# EAGLE design noisy (EAGLE 8.6.1)

## Sheet 1 of 2
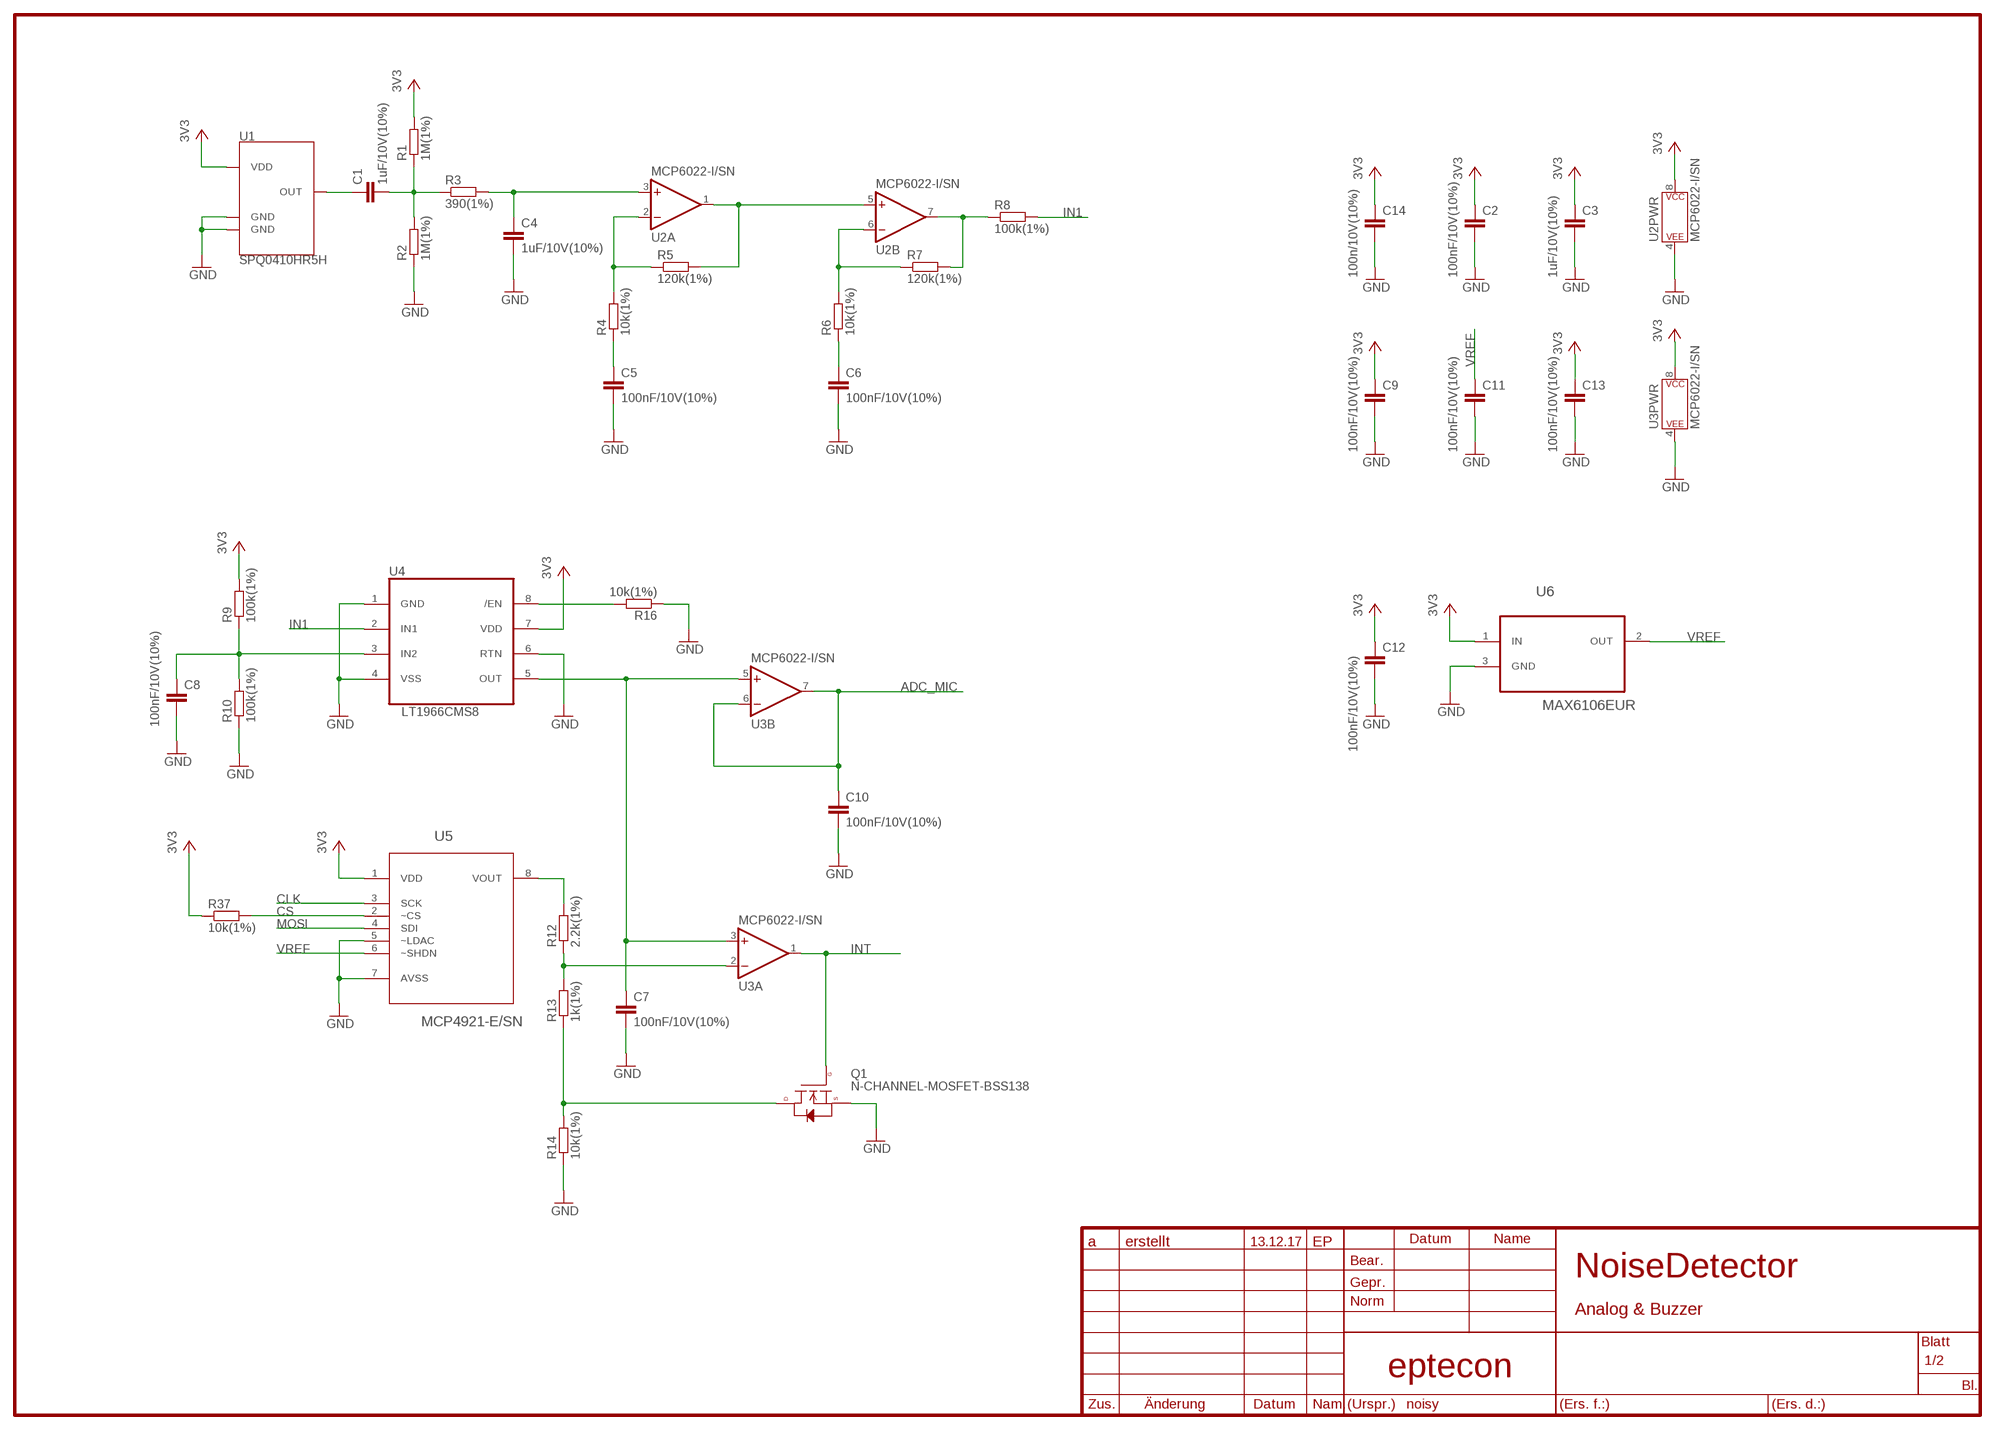
[diagram p0: schematic, sheet 1]

### Parts
C1  1uF/10V(10%)  C-EUC0603  [C0603]
C2  100nF/10V(10%)  C-EUC0603  [C0603]
C3  1uF/10V(10%)  C-EUC0603  [C0603]
C4  1uF/10V(10%)  C-EUC0603  [C0603]
C5  100nF/10V(10%)  C-EUC0603  [C0603]
C6  100nF/10V(10%)  C-EUC0603  [C0603]
C7  100nF/10V(10%)  C-EUC0603  [C0603]
C8  100nF/10V(10%)  C-EUC0603  [C0603]
C9  100nF/10V(10%)  C-EUC0603  [C0603]
C10  100nF/10V(10%)  C-EUC0603  [C0603]
C11  100nF/10V(10%)  C-EUC0603  [C0603]
C12  100nF/10V(10%)  C-EUC0603  [C0603]
C13  100nF/10V(10%)  C-EUC0603  [C0603]
C14  100n/10V(10%)  C-EUC0603  [C0603]
Q1  N-CHANNEL-MOSFET-BSS138  [SOT23-3]
R1  1M(1%)  R-EU_R0603  [R0603]
R2  1M(1%)  R-EU_R0603  [R0603]
R3  390(1%)  R-EU_R0603  [R0603]
R4  10k(1%)  R-EU_R0603  [R0603]
R5  120k(1%)  R-EU_R0603  [R0603]
R6  10k(1%)  R-EU_R0603  [R0603]
R7  120k(1%)  R-EU_R0603  [R0603]
R8  100k(1%)  R-EU_R0603  [R0603]
R9  100k(1%)  R-EU_R0603  [R0603]
R10  100k(1%)  R-EU_R0603  [R0603]
R12  2.2k(1%)  R-EU_R0603  [R0603]
R13  1k(1%)  R-EU_R0603  [R0603]
R14  10k(1%)  R-EU_R0603  [R0603]
R16  10k(1%)  R-EU_R0603  [R0603]
R37  10k(1%)  R-EU_R0603  [R0603]
U1  SPQ0410HR5H  [SPQ0410HR]
U2  MCP6022-I/SN  [SOIC08]
U3  MCP6022-I/SN  [SOIC08]
U4  LT1966CMS8  [MSOP8]
U5  MCP4921-E/SN  [SOIC8-N_MC]
U6  MAX6106EUR  [SOT23-3]

### Nets
3V3: C2.1 C3.1 C9.1 C12.1 C13.1 C14.1 R1.2 R9.2 R37.1 U1.P$1(VDD) U2.8(PWR:P$V+) U3.8(PWR:P$V+) U4.7(VDD) U5.1(VDD) U6.1(IN) ; also sheet 2
ADC_MIC: C10.1 U3.6(B:-IN) U3.7(B:OUT) ; also sheet 2
CLK: U5.3(SCK) ; also sheet 2
CS: R37.2 U5.2(~CS) ; also sheet 2
GND: C2.2 C3.2 C4.2 C5.2 C6.2 C7.2 C8.2 C9.2 C10.2 C11.2 C12.2 C13.2 C14.2 Q1.2(S) R2.1 R10.1 R14.1 R16.1 U1.P$2(GND) U1.P$3(GND) U2.4(PWR:P$V-) U3.4(PWR:P$V-) U4.1(GND) U4.4(VSS) U4.6(RTN) U5.5(~LDAC) U5.7(AVSS) U6.3(GND) ; also sheet 2
IN1: R8.2 U4.2(IN1)
INT: Q1.1(G) U3.1(A:OUT) ; also sheet 2
MOSI: U5.4(SDI) ; also sheet 2
N$1: C1.1 U1.P$4(OUT)
N$2: C1.2 R1.1 R2.2 R3.1
N$3: C4.1 R3.2 U2.3(A:+IN)
N$4: R4.2 R5.1 U2.2(A:-IN)
N$5: C5.1 R4.1
N$6: R5.2 U2.1(A:OUT) U2.5(B:+IN)
N$7: R6.2 R7.1 U2.6(B:-IN)
N$8: C6.1 R6.1
N$9: R7.2 R8.1 U2.7(B:OUT)
N$11: C8.1 R9.1 R10.2 U4.3(IN2)
N$12: R12.2 U5.8(VOUT)
N$13: R12.1 R13.2 U3.2(A:-IN)
N$14: Q1.3(D) R13.1 R14.2
N$15: C7.1 U3.3(A:+IN) U3.5(B:+IN) U4.5(OUT)
N$42: R16.2 U4.8(/EN)
VREF: C11.1 U5.6(~SHDN) U6.2(OUT)

### Notes on the sheet
- a | erstellt | 13.12.17 | EP
- NoiseDetector
- Analog & Buzzer
- eptecon

## Sheet 2 of 2
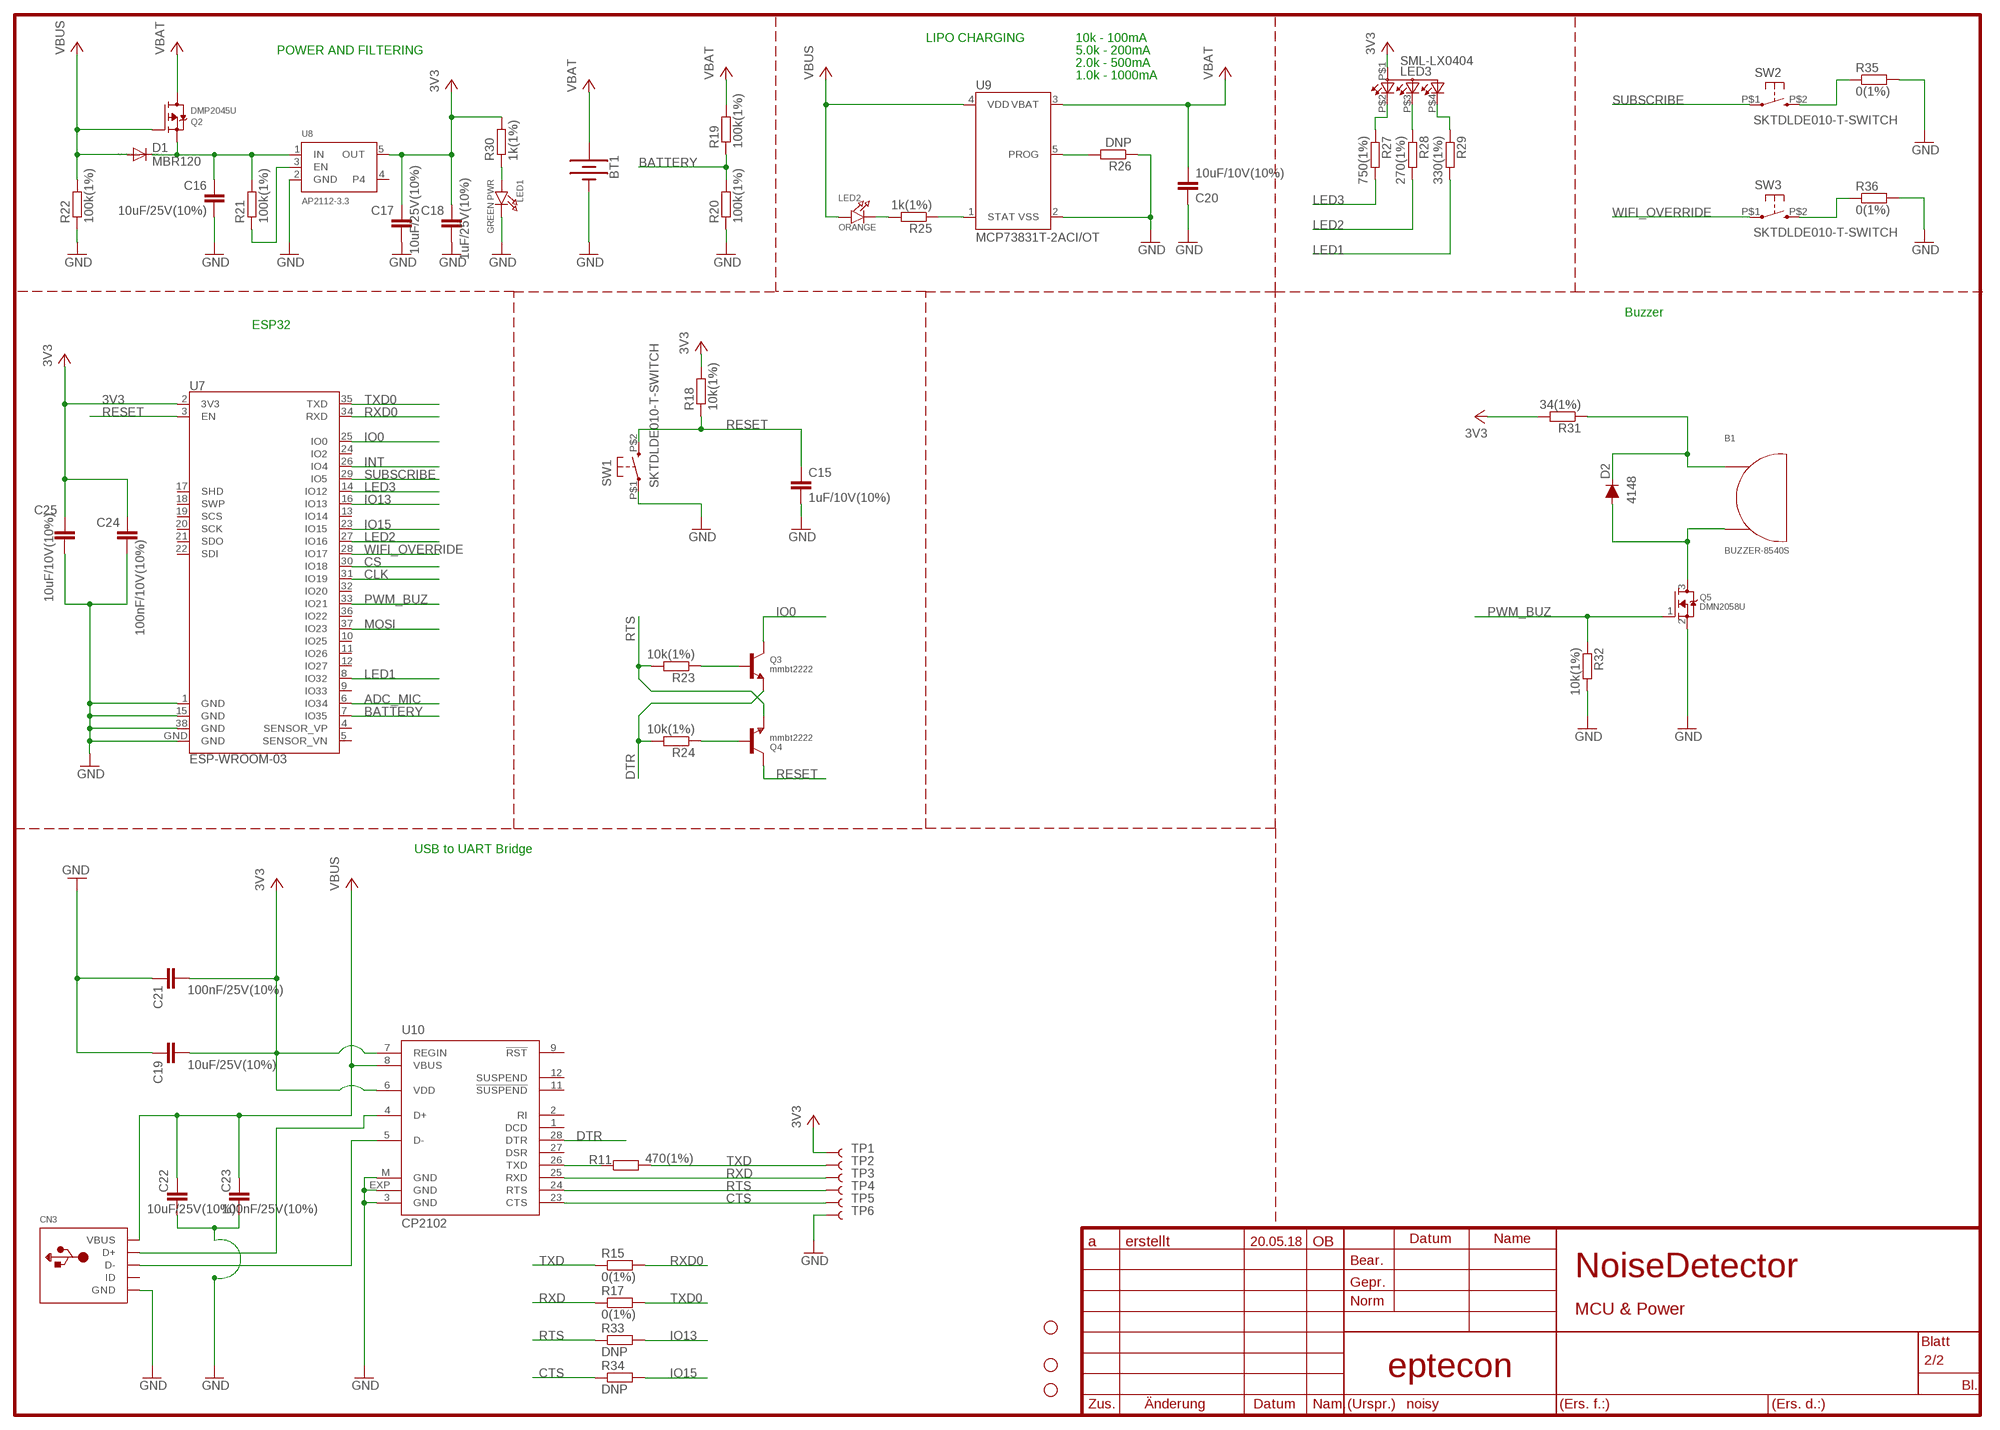
[diagram p1: schematic, sheet 2]

### Parts
B1  BUZZER-8540S  [BUZZER-8540S]
BT1  BATTERY-AA  [BATTERY-AA]
C15  1uF/10V(10%)  C-EUC0603  [C0603]
C16  10uF/25V(10%)  C-EUC0603  [C0603]
C17  10uF/25V(10%)  C-EUC0603  [C0603]
C18  1uF/25V(10%)  C-EUC0603  [C0603]
C19  10uF/25V(10%)  C-EUC0603  [C0603]
C20  10uF/10V(10%)  C-EUC0603  [C0603]
C21  100nF/25V(10%)  C-EUC0603  [C0603]
C22  10uF/25V(10%)  C-EUC0603  [C0603]
C23  100nF/25V(10%)  C-EUC0603  [C0603]
C24  100nF/10V(10%)  C-EUC0603  [C0603]
C25  10uF/10V(10%)  C-EUC0603  [C0603]
CN3  USBMINIBLARGE  [USB-MINIB_LARGER]
D1  MBR120  MBR0520LT  [SOD123]
D2  4148  DIODE-BAS16J  [SOD-323]
H1  STAND-OFF  [STAND-OFF]
H2  STAND-OFF  [STAND-OFF]
H3  STAND-OFF  [STAND-OFF]
LED1  GREEN PWR  LED0805_NOOUTLINE  [CHIPLED_0805_NOOUTLINE]
LED2  ORANGE  LED0805_NOOUTLINE  [CHIPLED_0805_NOOUTLINE]
LED3  SML-LX0404  [LED_RGB]
Q2  DMP2045U  MOSFET-P  [SOT23-R]
Q3  mmbt2222  TRANSISTOR_NPN  [SOT23-R]
Q4  mmbt2222  TRANSISTOR_NPN  [SOT23-R]
Q5  DMN2058U  MOSFET-NREFLOW  [SOT23-R]
R11  470(1%)  R-EU_R0603  [R0603]
R15  0(1%)  R-EU_R0603  [R0603]
R17  0(1%)  R-EU_R0603  [R0603]
R18  10k(1%)  R-EU_R0603  [R0603]
R19  100k(1%)  R-EU_R0603  [R0603]
R20  100k(1%)  R-EU_R0603  [R0603]
R21  100k(1%)  R-EU_R0603  [R0603]
R22  100k(1%)  R-EU_R0603  [R0603]
R23  10k(1%)  R-EU_R0603  [R0603]
R24  10k(1%)  R-EU_R0603  [R0603]
R25  1k(1%)  R-EU_R0603  [R0603]
R26  DNP  R-EU_R0603  [R0603]
R27  750(1%)  R-EU_R0603  [R0603]
R28  270(1%)  R-EU_R0603  [R0603]
R29  330(1%)  R-EU_R0603  [R0603]
R30  1k(1%)  R-EU_R0603  [R0603]
R31  34(1%)  R-EU_R0603  [R0603]
R32  10k(1%)  R-EU_R0603  [R0603]
R33  DNP  R-EU_R0603  [R0603]
R34  DNP  R-EU_R0603  [R0603]
R35  0(1%)  R-EU_R0603  [R0603]
R36  0(1%)  R-EU_R0603  [R0603]
SW1  SKTDLDE010-T-SWITCH  [T-SWITCH-ALPS-2]
SW2  SKTDLDE010-T-SWITCH  [T-SWITCH-ALPS-2]
SW3  SKTDLDE010-T-SWITCH  [T-SWITCH-ALPS-2]
TP1  TEST-POINT3X5  [PAD.03X.05]
TP2  TEST-POINT3X5  [PAD.03X.05]
TP3  TEST-POINT3X5  [PAD.03X.05]
TP4  TEST-POINT3X5  [PAD.03X.05]
TP5  TEST-POINT3X5  [PAD.03X.05]
TP6  TEST-POINT3X5  [PAD.03X.05]
U7  ESP-WROOM-03  [ESP-WROOM-03]
U8  AP2112-3.3  VREG_SOT23-5  [SOT23-5]
U9  MCP73831T-2ACI/OT  MCP73831  [SOT23-5]
U10  CP2102  [MLP28]

### Nets
3V3: C17.1 C18.1 C19.2 C21.2 C24.1 C25.1 LED3.P$1(A2) R18.2 R30.2 R31.2 TP1.P$1 U7.2(3V3) U8.5(OUT) U10.6(VDD) U10.7(REGIN) ; also sheet 1
ADC_MIC: U7.6(IO34) ; also sheet 1
BATTERY: R19.1 R20.2 U7.7(IO35)
CLK: U7.31(IO19) ; also sheet 1
CS: U7.30(IO18) ; also sheet 1
CTS: R34.1 TP5.P$1 U10.23(CTS)
DTR: Q3.2(E) R24.2 U10.28(DTR)
GND: BT1.GND@1(-) C15.2 C16.2 C17.2 C18.2 C19.1 C20.1 C21.1 C22.1 C23.1 C24.2 C25.2 CN3.GND LED1.C Q5.2(S) R20.1 R22.1 R26.1 R32.2 R35.2 R36.2 SW1.P$1 TP6.P$1 U7.1(GND) U7.15(GND) U7.38(GND) U7.GND U8.2(GND) U9.2(VSS) U10.3(GND) U10.EXP(GND) U10.M(GND) ; also sheet 1
INT: U7.26(IO4) ; also sheet 1
IO0: Q3.3(C) U7.25(IO0)
IO13: R33.2 U7.16(IO13)
IO15: R34.2 U7.23(IO15)
LED1: R29.2 U7.8(IO32)
LED2: R28.2 U7.27(IO16)
LED3: R27.2 U7.14(IO12)
MOSI: U7.37(IO23) ; also sheet 1
N$10: C16.1 D1.C Q2.2(S) R21.2 U8.1(IN)
N$24: Q4.1(B) R24.1
N$25: R11.1 U10.26(TXD)
N$26: Q3.1(B) R23.1
N$27: CN3.D+ U10.4(D+)
N$28: CN3.D- U10.5(D-)
N$29: R35.1 SW2.P$2
N$31: R36.1 SW3.P$2
N$32: LED3.P$2(CRED) R27.1
N$33: R25.1 U9.1(STAT)
N$34: LED2.C R25.2
N$35: LED3.P$3(CBLUE) R28.1
N$36: LED3.P$4(CGREEN) R29.1
N$37: R26.2 U9.5(PROG)
N$38: R21.1 U8.3(EN)
N$39: LED1.A R30.1
N$40: B1.PLUS D2.C R31.1
N$41: B1.MINUS D2.A Q5.3(D)
PWM_BUZ: Q5.1(G) R32.1 U7.33(IO21)
RESET: C15.1 Q4.3(C) R18.1 SW1.P$2 U7.3(EN)
RTS: Q4.2(E) R23.2 R33.1 TP4.P$1 U10.24(RTS)
RXD: R17.1 TP3.P$1 U10.25(RXD)
RXD0: R15.2 U7.34(RXD)
SUBSCRIBE: SW2.P$1 U7.29(IO5)
TXD: R11.2 R15.1 TP2.P$1
TXD0: R17.2 U7.35(TXD)
VBAT: BT1.PWR@1(+) C20.2 Q2.3(D) R19.2 U9.3(VBAT)
VBUS: C22.2 C23.2 CN3.VBUS D1.A LED2.A Q2.1(G) R22.2 U9.4(VDD) U10.8(VBUS)
WIFI_OVERRIDE: SW3.P$1 U7.28(IO17)
Unconnected: CN3.ID U7.4(SENSOR_VP) U7.5(SENSOR_VN) U7.9(IO33) U7.10(IO25) U7.11(IO26) U7.12(IO27) U7.13(IO14) U7.17(SHD) U7.18(SWP) U7.19(SCS) U7.20(SCK) U7.21(SDO) U7.22(SDI) U7.24(IO2) U7.32(IO20) U7.36(IO22) U8.4 U10.1(DCD) U10.2(RI) U10.9(!RST) U10.11(!SUSPEND) U10.12(SUSPEND) U10.27(DSR)

### Notes on the sheet
- LIPO CHARGING | 10k - 100mA
- POWER AND FILTERING | 5.0k - 200mA
- 2.0k - 500mA
- 1.0k - 1000mA
- Buzzer
- ESP32
- USB to UART Bridge
- a | erstellt | 20.05.18 | OB
- NoiseDetector
- MCU & Power
- eptecon

## Library data of the parts
B1 = GueLogics:BUZZER-8540S
BT1 = SparkFun-Batteries:BATTERY: Battery - Single Cell A variety of battery chemistries, sizes, and footprints. Device List: 20MM_PTH - Coin Cell Battery Holder - 20mm (PTH) <https://www.sparkfun.com/products/783> 6.8MM_PTH - Coin Cell Battery Holder - 6.8MM(SMD) <https://www.digikey.com/product-detail/en/seiko-instruments/MS621FE-FL11E/728-1057-ND/1889208?WT.srch=1&gclid=CNOQ5a6LzdQCFZS2wAodXCkE0g> 12MM_SMD - Coin Cell Battery Holder - 12mm (SMD) <https://www.sparkfun.com/products/10592> 12MM_PTH - Coin Cell Battery Holder - 12mm (PTH) <https://www.sparkfun.com/products/7948> 20MM_SMD - 20mm Coin Cell Battery Holder (SMD) (2 legs) Used on the Big Time Watch Kit <https://www.sparkfun.com/products/11734> 20MM_SMD_4LEGS - Coin Cell Battery Holder - 20mm (SMD) <https://www.sparkfun.com/products/11892> 20MM_SMD_4LEGS_OVERPASTE - Coin Cell Battery Holder - 20mm (SMD) <https://www.sparkfun.com/products/11892> (Over-paste on the legs) 24.5MM_PTH - Coin Cell Battery Holder - 24.5mm (PTH) <https://www.sparkfun.com/products/8863> 9V - 9V Battery Holder - PC Mount Used on the SparkFun SparkPunk Sound Kit <https://www.sparkfun.com/products/11177> and SparkFun SparkPunk Sequencer Kit <https://www.sparkfun.com/products/12707> 18650 - Battery Holder - 18650 (PTH) <https://www.sparkfun.com/products/13113> AA - Battery Holder - 1xAA (PTH) <https://www.sparkfun.com/products/7949> AAA - Battery Holder - 1xAAA (PTH) <https://www.sparkfun.com/products/12718> AA_KIT - Battery Holder - 1xAA (PTH) <https://www.sparkfun.com/products/7949> Special kit package - pads only have exposed copper on one side of the board. AAA_KIT - Battery Holder - 1xAAA (PTH) <https://www.sparkfun.com/products/12718> Special kit package - pads only have exposed copper on one side of the board.; PROD_ID: BATT-08316; SF_SKU: PRT-07949
C1-C25 = rcl:C-EU: CAPACITOR, European symbol
CN3 = microbuilder:USB: USB Connectors USBMINIB - Surface Mount Female Mini-B USB Connector 4UConnector: 06564
D1 = diode:MBR0520LT: SCHOTTKY BARRIER RECTIFIER Source: http://onsemi.com .. MBR0520LT1-D.pdf
D2 = SparkFun-DiscreteSemi:DIODE: Diode These are standard reverse protection diodes and small signal diodes. SparkFun Products: SparkFun SparkPunk Sound Kit <https://www.sparkfun.com/products/11177> SparkFun ESP8266 Thing <https://www.sparkfun.com/products/13231>; PROD_ID: DIO-09646; VALUE: 250mA/100V
H1-H3 = SparkFun-Hardware:STAND-OFF: Stand Off Drill holes for mechanically mounting via screws, standoffs, etc. Note: Use the keepout ring to avoid running the screw head into surrounding components. Variant Overviews STAND-OFF - Mechanical footprint for a #4 phillips button head screw. STAND-OFF-TIGHT - Mechanical footprint for a #4 phillips button head screw, Example SparkFun Products Screw - Phillips Head (1/4", 4-40, 10 pack) <https://www.sparkfun.com/products/10453> (PRT-10453) Screw - Phillips Head (1/2", 4-40, 10 pack) <https://www.sparkfun.com/products/10452> (PRT-10452) Screw - Phillips Head (3/4", 4-40, 10 pack) <https://www.sparkfun.com/products/10451> (PRT-10451) Screw - Phillips Head (1", 4-40, 10 pack) <https://www.sparkfun.com/products/10450> (PRT-10450)
LED1 LED2 = microbuilder:LED: LED 0603 - 0603 Surface Mount Package 2mA: Green LED - Low Power (3.9mcd, 2ma, 1.7Vf) - Digikey: 475-2709-2-ND Orange LED - Low Power (9.8mcd, 2ma, 1.8Vf) - Digikey: 475-1194-2-ND Red LED - Low Power (5mcd, 2ma, 1.8Vf) - Digikey: 475-1195-2-ND Yellow LED - Low Power (7mcd, 2ma, 1.8Vf) - Digikey: 475-1196-2-ND 5mA: Blue LED - Low Power (17mcd, 5ma, 2.9Vf) - Digikey: LNJ937W8CRACT-ND 0805 - 0805 Surface Mount Package 2mA: Red LED (8.8mcd, 2mA, 1.8Vf, Clear) - Low Power [Digikey: 475-2510-1-ND] Green LED (5mcd, 2mA, 1.8Vf, Clear) - Low Power [Digikey: 475-2730-1-ND] Yellow LED (11.3mcd, 2mA, 1.8Vf, Clear) - Low Power [Digikey: 475-2555-1-ND] 20mA: Red LED (104mcd, 20mA, Diffused) - LS R976 [Digikey: 475-1278-6-ND] Red LED (12mcd, 20mA, 2.0Vf, Clear) - APT2012EC [Digikey: 754-1128-1-ND] Green LED (15mcd, 20mA, 2.2Vf, Clear) - APT2012GC [Digikey: 754-1131-1-ND] Orange LED (160mcd, 20mA, 2.1Vf, Clear) - APT2012SECK [Digikey: 754-1130-1-ND] 1206 - 1206 Surface Mount Package Green LED (26mcd, 20mA, Diffused) - LG N971 [Digikey: 475-1407-6-ND] Red LED (15mcd, 20mA, Diffused) - LH N974 [Digikey: 475-1416-6-ND]
LED3 = led:SML-LX0404
Q1 = GeekAmmo:N-CHANNEL-MOSFET: N-Channel MOSFET Mode Field Effect Transistor; DATASHEET: http://www.fairchildsemi.com/ds/BS/BSS138.pdf; DIGIKEY: BSS138TR-ND; ELEMENT14: 2323154; URL: http://au.element14.com/fairchild-semiconductor/bss138/mosfet-n-ch-50v-220ma-sot-23/dp/2323154
Q2 = microbuilder:MOSFET-P: P-Channel Mosfet LEGEND VDS: Voltage Drain-Source ID: Drain Current RDS(ON): Drain-Source On-State Resistance VGS(TH): Gate-Source Threshold Voltage CISS: Drain-Source Input Capacitance SOT-23 Name VDS ID RDS(ON) VGS(TH) CISS Order Number IRLML5103 30V 760mA 600 mOhm -- 75pF @ 25V Digikey: IRLML5103PBFCT-ND IRLML6401 12V 4.3A 50 mOhm 950mV @ 250µA 830pF @ 10V Digikey: IRLML6401PBFTR-ND NTR0202PL 20V 400mA 800 mOhm 2.3V @ 250uA 70pF @ 5V Digikey: NTR0202PLT1GOSTR-ND NTR4101PT1G 20V 1.8A 85 mOhm 1.2V @ 250uA 675pF @ 10V Digikey: NTR4101PT1GOSCT-ND DMP2004K 20V 600mA 900 mOhm 1V @ 250uA 175pF @ 16V Digikey: DMP2004KDICT-ND PMV65XP 20V 3.9A 76 mOhm 950mV @ 1mA 725pF @ 20V Digikey: 568-2358-2-ND TO-252 Name VDS ID RDS(ON) VGS(TH) CISS Order Number AOD417 30V 25A 34 mOhm 3V @ 250µA 920pF @ 15V Digikey: 785-1106-2-ND
Q3 Q4 = microbuilder:TRANSISTOR_NPN: NPN Transistor Transistor (NPN) 500mA 45V - BC817 [Digikey: 568-1631-1-ND] Transistor (NPN) 500mA 45V - BC817,215 [Mouser: 771-BC817-T/R] SOT23-R - SOT23 footprint optimised for use with solder paste and reflow ovens. SOT23-W - SOT23 footprint optimised for hand-soldering (larger pads).
Q5 = microbuilder:MOSFET-N: N-Channel Mosfet LEGEND VDS: Voltage Drain-Source ID: Drain Current RDS(ON): Drain-Source On-State Resistance VGS(TH): Gate-Source Threshold Voltage CISS: Drain-Source Input Capacitance SOT-23 Name VDS ID RDS(ON) VGS(TH) CISS Order Number 2N7002E 60V 260mA 2.5 Ohm 2.5V @ 250uA 26.7pF @ 25V 2N7002ET1GOSTR-ND BSH103 30V 850mA 400 mOhm 400mV @ 1mA 83pF @ 24V BSH103,235-ND BSS138 60V 320mA 1.6 Ohm 1.5V @ 250uA 50pF @ 10V Mouser: 771-BSS138PW115 DMN2075U-7 20V 4.2A 38 mOhm 1V @ 250 uA 594.3pF @ 10V DMN2075U-7DICT-ND * BSS138 good choice for I2C level-shifting
R1-R37 = rcl:R-EU_: RESISTOR, European symbol
SW1-SW3 = GeekAmmo:SKTDLDE010-T-SWITCH
TP1-TP6 = SparkFun-Connectors:TEST-POINT: SparkFun Test Points Bare copper test points for troubleshooting or In-Circuit-Testing. These are used by our Production team for verifying production board runs using pogo-pins on test beds. SparkFun Products: SparkFun LSM9DS1 Breakout <https://www.sparkfun.com/products/13284> SparkFun PSOC <https://www.sparkfun.com/products/13714> SparkFun Load Cell Amplifier <https://www.sparkfun.com/products/13879>
U1 = GueLogics:SPQ0410HR5H: MESM microphone
U2 U3 = GueLogics:MCP6022-I/SN: IC OPAMP 2.5V DUAL R-R
U4 = GueLogics:LT1966CMS8: Precision Micropower, DS RMS-to-DC Converter
U5 = Microchip_By_element14_Batch_1:MCP4921-E/SN: 12 Bit DAC; DESCRIPTION: 12 Bit DAC; MPN: MCP4921-E/SN; OC_FARNELL: 1332113; OC_NEWARK: 08J8744; PACKAGE: SOIC-8; SUPPLIER: Microchip
U6 = GueLogics:MAX6106EUR: VOLTAGE REFERENCE
U7 = esp32-thing-temp:ESP-WROOM-03
U8 = microbuilder:VREG_SOT23-5: SOT23-5 Fixed Voltage Regulators To better organise some of the SOT23-5 fixed voltage regulators in this library, this new part was created. Part Current Out V Out V In V Dropout Digikey Part No. ADP121 150mA 3.3V 3.4-5.5V 0.09V @ 150mA ADP121-AUJZ33R7CT-ND ADP121 150mA 3.0V 3.1-5.5V 0.09V @ 150mA ADP121-AUJZ30R7CT-ND ADP122 300mA 3.3V 3.4-5.5V 0.085V @ 300mA ADP122AUJZ-3.3-R7CT-ND ADP1712 300mA 3.3V 3.5-5.5V 0.17V @ 300mA ADP1712AUJZ-3.3-R7TR-ND AP7311 (Low Cost) 150mA 3.3V 3.5-6V 0.15V @ 150mA AP7311-33WG-7DICT-ND LD39015M18R 150mA 1.8V 1.9V-5.5V 0.08V @ 100mA 497-6977-1-ND MCP1824T-3302E/OT 300mA 3.3V 3.5V-6V 0.2V @ 300mA MCP1824T-3302E/OTCT-ND MIC5205-2.5YM5 TR 150mA 2.5V 2.7-16V 0.165V @ 150mA 576-1257-2-ND MIC5205-3.0YM5 TR 150mA 3.0V 3.2V-16V 0.165V @ 150mA 576-1258-2-ND MIC5205-3.3YM5 TR 150mA 3.3V 3.5V-16V 0.165V @ 150mA 576-1259-2-ND TPS780330220 150mA 3.3V+2.2V 3.6-5.5V 250mV Max 296-23332-1-ND TDA3663/N1,135 100mA 3.3V 3.5-45V 0.18V @ 50mA 568-5343-1-ND
U9 = GeekAmmo:MCP73831: MCP73831 Miniature Single-Cell, Fully Integrated Li-Ion, Li-Polymer Charge Management Controllers The MCP73831/2 devices are highly advanced linear charge management controllers for use in spacelimited, cost-sensitive applications. http://ww1.microchip.com/downloads/en/DeviceDoc/20001984F.pdf
U10 = silabs:CP210*: Single-Chip USB to UART Bridge Source: www.silabs.com .. CP2101.pdf / cp2102.pdf; MF: FARNELL; MPN: CP2102-GM; OC_FARNELL: 9282130; OC_NEWARK: 30K5635

## Board
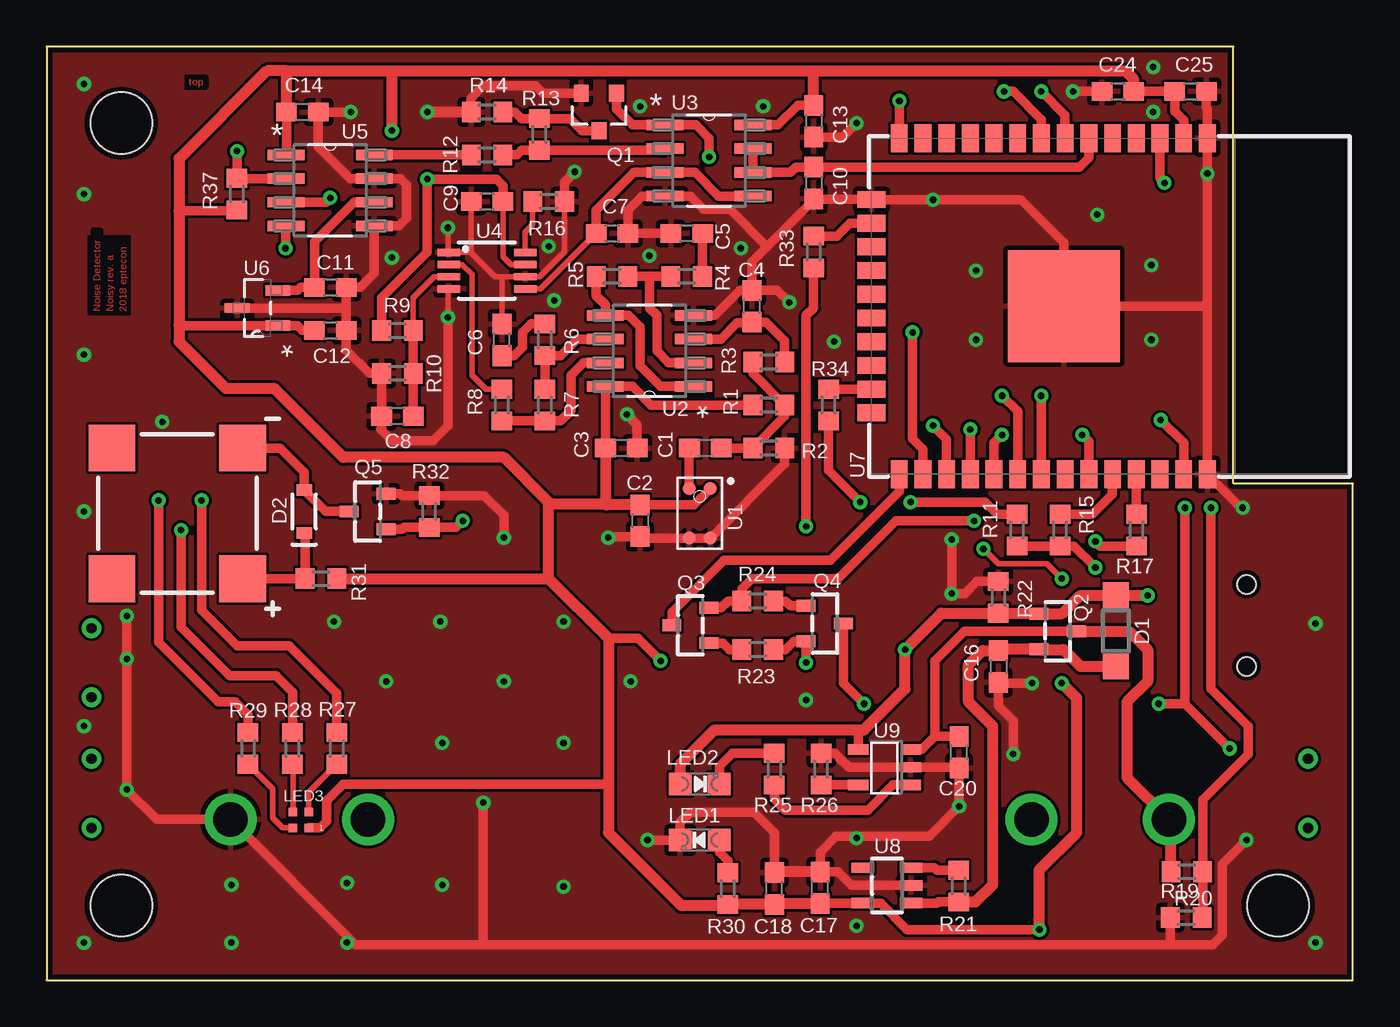
[diagram p2: board, top side]
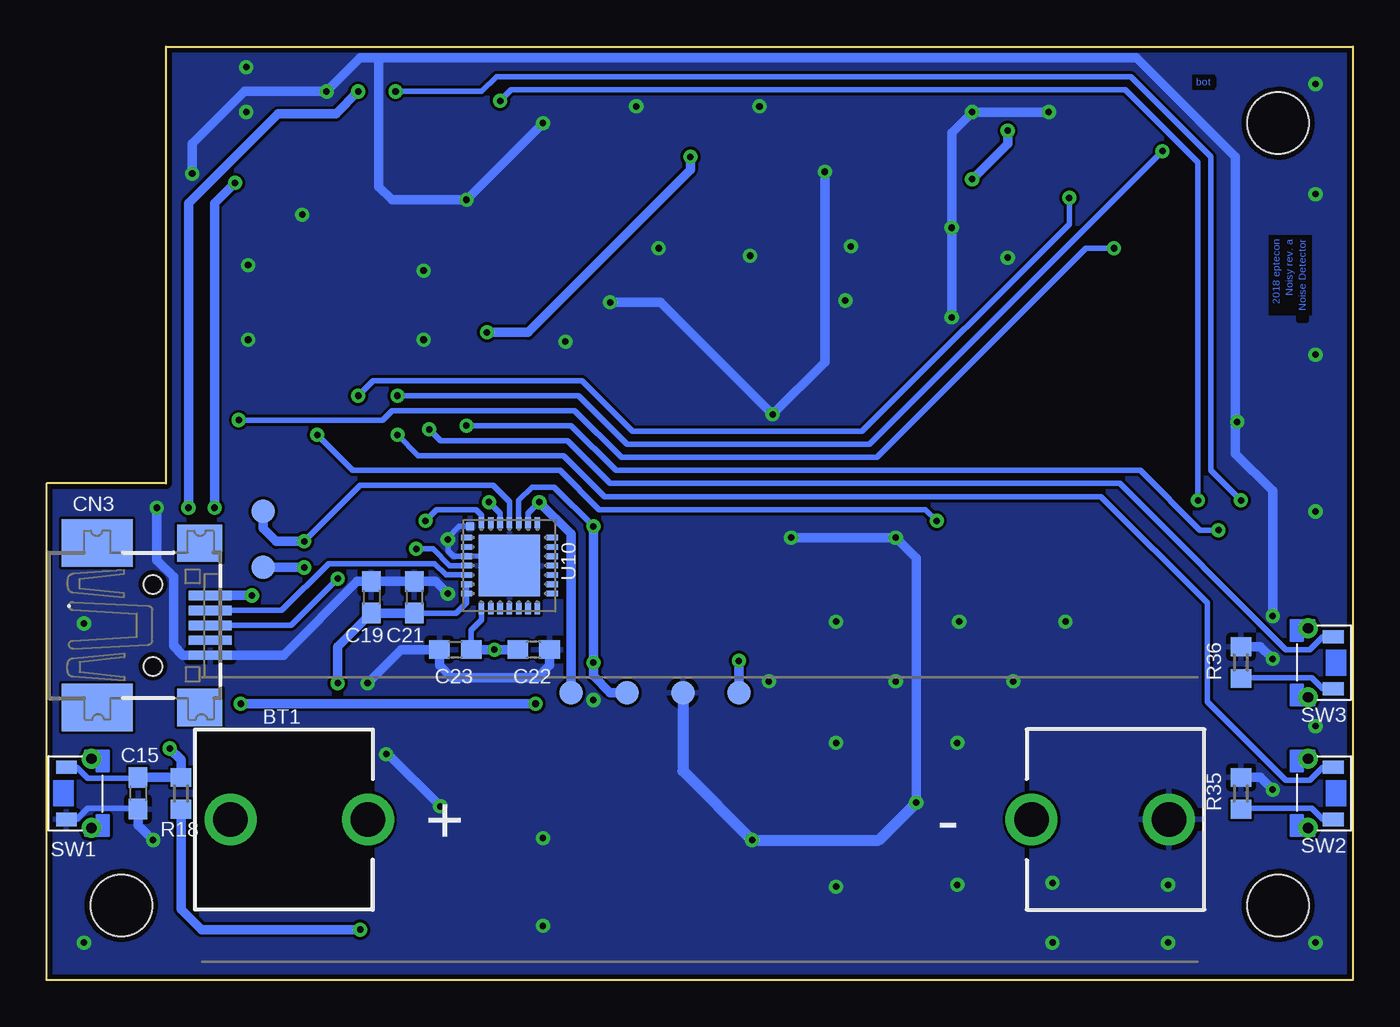
[diagram p3: board, bottom side, seen from below]

Size 70 x 50 mm. Coordinates in mm from the lower left corner, seen from the top.
Outline: 0,0 70,0 70,26.6 63.6,26.6 63.6,50 0,50 0,0
Copper layers (1*16): Top 0.035mm / dielectric 1.5mm / Bottom 0.035mm
Design rules "default *": minimum track width 10mil, minimum drill 10mil, track to track 6mil, track to pad 6mil, pad to pad 6mil, via to via 6mil, smd to smd 6mil, copper to edge 10mil, drill to drill 8mil, minimum pad ring 10mil, minimum via ring 8mil, stop-mask expansion 4mil, vias tented up to drill 0mil, thermal gap 10mil
tRestrict: area 2.2,35.6 to 4.5,39.9; area 7.4,47.7 to 8.6,48.5
bRestrict: area 2.2,35.6 to 4.5,39.9; area 7.4,47.7 to 8.6,48.5

### Footprints (pad centres in the part's own frame; a part is rotated, then mirrored left to right if it is on the bottom)
BUZZER-8540S = smd 2.5 x 2.5: 3 3.5,-3.5; 4 3.5,3.5; MINUS -3.5,-3.5; PLUS -3.5,3.5
BATTERY-AA = drill 1.854: GND@1 25.146,0; GND@2 17.78,0; PWR@1 -25.146,0; PWR@2 -17.78,0
C0603 = smd 1.1 x 1: 1 -0.85,0; 2 0.85,0
USB-MINIB_LARGER = smd 0.5 x 2.308: D+ 0,4.064; D- -0.8,4.064; GND 1.6,4.064; ID 0.8,4.064; VBUS -1.6,4.064 | smd 2.54 x 3.81: GND1 -4.4,-2; GND4 4.4,-2 | smd 2 x 2.4: GND2 -4.4,3.5; GND3 4.4,3.5 | hole 1: -2.2,1; 2.2,1
SOD123 = smd 1.4 x 1.4: A 1.9,0; C -1.9,0
SOD-323 = smd 0.63 x 0.83: A 1.15,0; C -1.15,0
STAND-OFF = hole 3.302: 0,0
CHIPLED_0805_NOOUTLINE = smd 1.2 x 1.2: A 0,-1.05; C 0,1.05
LED_RGB = smd 0.45 x 0.45: P$1 -0.45,-0.45; P$2 0.4,-0.45; P$3 0.4,0.4; P$4 -0.45,0.4
SOT23-3 = smd 0.8 x 0.9: 1 -0.95,-1; 2 0.95,-1; 3 0,1
SOT23-R = smd 0.635 x 1.016: 1 -0.95,-1; 2 0.95,-1; 3 0,1
R0603 = smd 1 x 1.1: 1 -0.85,0; 2 0.85,0
T-SWITCH-ALPS-2 = smd 0.7 x 1.1: P$1 -1.4,1.35; P$2 1.4,1.35 | drill 0.55 pad 0.6: P$3 -1.85,0; P$4 1.85,0
PAD.03X.05 = smd 1.27 x 1.27: P$1 0,0
SPQ0410HR = smd 0.7 x 0.7: P$1 0.575,1.33; P$2 0.575,-1.33; P$3 -0.575,-1.33; P$4 -0.575,1.33
SOIC08 = smd 1.981 x 0.559: 1 -2.362,1.905; 2 -2.362,0.635; 3 -2.362,-0.635; 4 -2.362,-1.905; 5 2.362,-1.905; 6 2.362,-0.635; 7 2.362,0.635; 8 2.362,1.905
MSOP8 = smd 0.4 x 1.2: 1 -0.975,-2.05; 2 -0.325,-2.05; 3 0.325,-2.05; 4 0.975,-2.05; 5 0.975,2.05; 6 0.325,2.05; 7 -0.325,2.05; 8 -0.975,2.05
SOIC8-N_MC = smd 1.981 x 0.559: 1 -2.362,1.905; 2 -2.362,0.635; 3 -2.362,-0.635; 4 -2.362,-1.905; 5 2.362,-1.905; 6 2.362,-0.635; 7 2.362,0.635; 8 2.362,1.905
SOT23-3' = smd 1.321 x 0.559: 1 -1.092,0.94; 2 -1.092,-0.94 | smd 1.321 x 0.508: 3 1.092,0
ESP-WROOM-03 = smd 0.9 x 1.5: 1 7.7,9; 2 6.43,9; 3 5.16,9; 4 3.89,9; 5 2.62,9; 6 1.35,9; 7 0.08,9; 8 -1.19,9; 9 -2.46,9; 10 -3.73,9; 11 -5,9; 12 -6.27,9; 13 -7.54,9; 14 -8.81,9; 25 -8.81,-9; 26 -7.54,-9; 27 -6.27,-9; 28 -5,-9; 29 -3.73,-9; 30 -2.46,-9; 31 -1.19,-9; 32 0.08,-9; 33 1.35,-9; 34 2.62,-9; 35 3.89,-9; 36 5.16,-9; 37 6.43,-9; 38 7.7,-9 | smd 1.5 x 0.9: 15 -10.3,5.715; 16 -10.3,4.445; 17 -10.3,3.175; 18 -10.3,1.905; 19 -10.3,0.635; 20 -10.3,-0.635; 21 -10.3,-1.905; 22 -10.3,-3.175; 23 -10.3,-4.445; 24 -10.3,-5.715 | smd 6 x 6: GND 0,0
SOT23-5 = smd 0.55 x 1.2: 1 -0.95,-1.3; 2 0,-1.3; 3 0.95,-1.3; 4 0.95,1.3; 5 -0.95,1.3
SOT23-5' = smd 0.55 x 1.1: 1 -0.95,-1.3; 2 0,-1.3; 3 0.95,-1.3; 4 0.95,1.5; 5 -0.95,1.5
MLP28 = smd 0.6 x 0.3: 1 -2.3,1.5; 2 -2.3,1; 3 -2.3,0.5; 4 -2.3,0; 5 -2.3,-0.5; 6 -2.3,-1; 7 -2.3,-1.5; 15 2.3,-1.5; 16 2.3,-1; 17 2.3,-0.5; 18 2.3,0; 19 2.3,0.5; 20 2.3,1; 21 2.3,1.5 | smd 0.3 x 0.6: 8 -1.5,-2.3; 9 -1,-2.3; 10 -0.5,-2.3; 11 0,-2.3; 12 0.5,-2.3; 13 1,-2.3; 14 1.5,-2.3; 22 1.5,2.3; 23 1,2.3; 24 0.5,2.3; 25 0,2.3; 26 -0.5,2.3; 27 -1,2.3; 28 -1.5,2.3 | smd 3.3 x 3.3: EXP 0,0 | smd 0.435 x 0.435: M -2.103,2.103

### Placement (x,y rotation side)
B1  7,25 180 top
BT1  35,8.6 0 bottom
C1  35.3,28.5 0 top
C2  31.8,24.6 270 top
C3  30.8,28.5 0 top
C4  37.8,36.1 90 top
C5  34.3,40 180 top
C6  24.4,34.29 90 top
C7  30.3,40 0 top
C8  18.8,30.2 180 top
C9  23.6,41.7 180 top
C10  41.1,42.7 270 top
C11  15.2,37.1 0 top
C12  15.2,34.8 0 top
C13  41.1,46 270 top
C14  13.7,46.5 0 top
C15  65.1,10 270 bottom
C16  51,16.8 270 top
C17  41.46,4.94 90 top
C18  39,4.9 90 top
C19  52.6,20.5 270 bottom
C20  48.9,12.2 90 top
C21  50.3,20.5 270 bottom
C22  43.9,17.7 180 bottom
C23  48.1,17.7 0 bottom
C24  57.4,47.6 180 top
C25  61.3,47.6 0 top
CN3  65.3,19 270 bottom
D1  57.3,18.7 90 top
D2  13.8,25.1 90 top
H1  4,45.9 0 top
H2  4,4 0 top
H3  66,4 0 top
LED1  35,7.5 90 top
LED2  35,10.5 270 top
LED3  13.6,8.6 90 top
Q1  29.6,46.5 180 top
Q2  54.18,18.68 270 top
Q3  34.5,19 90 top
Q4  41.7,19.1 270 top
Q5  17.2,25.1 90 top
R1  38.7,30.8 180 top
R2  38.7,28.5 180 top
R3  38.7,33.1 0 top
R4  34.3,37.7 180 top
R5  30.3,37.7 180 top
R6  26.7,34.3 270 top
R7  26.7,30.8 270 top
R8  24.4,30.8 90 top
R9  18.8,34.8 180 top
R10  18.8,32.5 0 top
R11  52,24.1 270 top
R12  23.6,44.2 180 top
R13  26.4,45.3 270 top
R14  23.6,46.5 0 top
R15  54.3,24.1 90 top
R16  26.9,41.7 180 top
R17  58.4,24.1 90 top
R18  62.8,10 270 bottom
R19  61.1,5.8 180 top
R20  61.07,3.34 0 top
R21  48.87,5.03 270 top
R22  51,20.5 270 top
R23  38.1,17.7 0 top
R24  38.1,20.3 180 top
R25  39,11.3 90 top
R26  41.5,11.3 270 top
R27  15.55,12.41 90 top
R28  13.17,12.41 90 top
R29  10.8,12.41 90 top
R30  36.5,4.9 270 top
R31  14.7,21.5 0 top
R32  20.5,25.1 90 top
R33  41.1,39 90 top
R34  41.9,30.8 90 top
R35  6,10 90 bottom
R36  6,17 90 bottom
R37  10.2,42.1 90 top
SW1  67.6,10 90 bottom
SW2  2.4,10 270 bottom
SW3  2.4,17 270 bottom
TP1  32.9,15.4 0 bottom
TP2  58.4,22.1 0 bottom
TP3  58.4,25.1 0 bottom
TP4  38.9,15.4 0 bottom
TP5  41.9,15.4 0 bottom
TP6  35.9,15.4 0 bottom
U1  35,25 0 top
U2  32.3,33.7 180 top
U3  35.5,43.9 0 top
U4  23.6,38 270 top
U5  15.2,42.3 0 top
U6  MAX6106EUR  [SOT23-3']  11.3,36 180 top
U7  54.5,36.1 0 top
U8  45.03,5.07 90 top
U9  MCP73831T-2ACI/OT  [SOT23-5']  45,11.4 90 top
U10  45.2,22.2 0 bottom

### Tracks (layer width: path | path; a pad name or v marks a point on that pad's centre or on a via)
3V3  (via drill 0.35)
  Top 0.3: C9.1 24.45,38.75 24.88,38.33 U4.7
  Top 0.5: U7.2 60.93,46.07 60.45,46.55 C25.1 C24.1 | R30.2 36.59,4.19 36.72,4.05 | C3.1 29.94,28.51 U2.8 29.95,31.78 29.97,31.8 31.4,31.8 32.4,30.8 R1.2 | C12.1 13.7,34.8 13.44,35.06 U6.1 7.14,35.06 7.1,35.1 | U5.1 12.85,44.22 C14.1 | C17.1 41.49,4.12 U8.5 43.75,4.1 44.7,4.1 46.1,2.7 v53.2,2.7 | 39.04,4.09 C18.1 | U3.8 39.2,45.8 40.25,46.85 C13.1 | C9.1 24.45,42.55 24.1,42.9 v20.4,42.9 20.4,39 17.95,36.55 R9.2 | 12.85,48.65 12.9,48.7 | C2.1 34.7,25.45 U1.P$1 | LED3.P$1 14.65,8.15 15,8.5 15,9.6 15.9,10.5 30.1,10.5 | R37.1 10.15,41.2 7.1,41.2 | 30.1,18.3 31.7,18.3 v32.9,17.1
  Top 0.6: C24.1 58.25,48.25 57.8,48.7 41.1,48.7 | 18.5,48.7 12.9,48.7 11.8,48.7 7.1,44 7.1,41.2 7.1,35.1 7.1,34.2 9.6,31.7 12.2,31.7 15.9,28 24.5,28 26.9,25.6 | 18.5,48.7 41.1,48.7 | C13.1 41.1,48.7 | C14.1 12.85,48.65 | C17.1 39.04,4.09 | C18.1 R30.2 36.45,4 34,4 30.1,7.9 30.1,10.5 30.1,18.3 26.9,21.5 | C2.1 30,25.45 29.95,25.5 | C3.1 29.95,25.5 | v18.5,45.5 18.5,48.7 | v53.2,2.7 53.2,5.9 55.2,7.9 55.2,15.1 v54.4,15.9 | 26.9,21.5 26.9,25.6 | 29.95,25.5 27,25.5 26.9,25.6 | R31.2 26.9,21.5
  Bottom 0.3: C21.2 48.05,19.65 47.5,20.2 U10.7 U10.6
  Bottom 0.5: C21.2 C19.2 54.4,17.85 v54.4,15.9 | v53.2,2.7 61.7,2.7 62.8,3.8 R18.2 | v20.4,42.9 18.5,44.8 v18.5,45.5 | TP1.P$1 v32.9,17.1
ADC_MIC
  Top 0.5: U7.6 55.85,44.05 55.35,43.55 C10.1 40.15,43.55 39.87,43.27 U3.6 U3.7
BATTERY  (via drill 0.35)
  Top 0.5: 62.12,5.77 R19.1 | R19.1 61.95,3.37 R20.2 | v62.4,25.3 62.4,15.6 64.4,13.6 64.4,12.1 61.95,9.65 R19.1 | U7.7 54.58,46.32 v53.3,47.6
  Bottom 0.5: v62.4,25.3 62.4,41.6 57.6,46.4 54.5,46.4 v53.3,47.6
CLK  (via drill 0.35)
  Top 0.5: U5.3 14.96,41.66 v15.2,41.9 | U7.31 v53.31,31.29 v53.3,31.3
  Bottom 0.3: v15.2,41.9 15.2,40.5 26.3,29.4 38.6,29.4 41.3,32.1 52.5,32.1 v53.3,31.3
CS  (via drill 0.35)
  Top 0.5: U5.2 10.21,42.94 R37.2 v10.2,44.4 | U7.30 52.04,30.46 v51.2,31.3
  Bottom 0.3: v10.2,44.4 25.9,28.7 38.9,28.7 41.5,31.3 v51.2,31.3
CTS  (via drill 0.35)
  Top 0.5: R34.1 41.9,27.3 v43.6,25.6
  Bottom 0.3: U10.23 44.2,25 v43.6,25.6
  Bottom 0.5: TP5.P$1 41.9,23.9 v43.6,25.6
DTR  (via drill 0.35)
  Top 0.5: Q3.2 36.15,19.95 36.5,20.3 R24.2 37.25,20.95 37.8,21.5 42.4,21.5 45.5,24.6 v49.7,24.6
  Bottom 0.3: v49.7,24.6 49.1,25.2 47,25.2 46.7,24.9 U10.28
GND  (via drill 0.35)
  Top 0.3: 24.4,37.67 U4.6 26.41,37.67 27.75,39.01 R16.1 | 24.4,37.67 24.02,37.67 22.73,38.98 | 22.73,38.98 U4.1 21.5,39.02 v21.5,40.3 | C9.2 22.75,39 22.73,38.98 | C6.2 24.4,37.67 | U4.4 21.5,36.98 v21.5,35.5
  Top 0.5: 62.2,36.3 v62.2,43.2 U7.1 62.2,46.7 62.15,46.75 C25.2 | 62.2,36.3 U7.38 64,25.3 v64.1,25.3 | 62.2,36.3 62,36.1 U7.GND 54.5,39.5 52.2,41.8 v47.5,41.8 44.22,41.8 U7.15 41.13,41.81 | U2.4 35.8,35.6 37.15,36.95 C4.2 | C5.2 C7.2 31.15,41.25 31.89,41.99 U3.4 34.51,41.99 35.21,41.29 36.61,41.29 38.61,39.29 | 16.05,35.8 C12.2 16.05,33.75 17.3,32.5 R10.1 C8.2 17.95,29.55 17.9,29.5 18.5,28.9 20.7,28.9 21.5,29.7 v21.5,35.5 | 16.05,35.8 C11.2 16.8,37.1 17.56,37.86 U5.5 18.9,40.4 19.3,40.8 19.3,42.6 18.96,42.94 U5.7 16.27,42.94 14.55,44.65 C14.2 v16.3,46.5 | U6.3 15.85,36 16.05,35.8 | Q5.2 18.95,26.05 19.05,25.95 R32.2 23.45,25.95 24.5,24.9 v24.5,23.7 | 41.13,41.81 C10.2 | U8.2 43.13,5.07 42.4,5.8 C17.2 | R26.1 42.25,12.15 42.5,11.9 42.5,11.89 42.98,11.4 U9.2 48.85,11.4 C20.1 v48.9,9.3 47.3,7.7 42.3,7.7 41.46,6.86 C17.2 | 41.42,5.75 C17.2 | C4.2 37.8,38.48 38.61,39.29 | 38.61,39.29 41.13,41.81 | C3.2 31.65,29.75 v31.1,30.3 | C4.2 39.15,36.95 v39.8,36.3 | Q1.2 26.6,47.5 26.2,47.9 23.4,47.9 22.75,47.25 R14.1 | R16.1 27.75,42.75 v28.3,43.3 | v64.3,7.5 63,6.2 63,2.4 62.5,1.9 60.2,1.9 | v52.8,15.9 51.05,15.9 C16.2 51,14.7 51.8,13.9 v51.8,12.1 | C18.2 39,7.9 37.9,9 34.5,9 33.95,8.45 LED1.C v32.2,7.5 | R22.1 49.85,21.35 49.2,20.7 v48.5,20.7 v48.5,23.6 | R2.1 39.55,27.64 U1.P$2 U1.P$3 31.88,23.67 C2.2 30.15,23.75 v30.1,23.7 | C24.2 v55,47.6 | v4.3,19.5 v4.3,17.2 v4.3,10.2 5.9,8.6 BT1.GND@1 16.55,1.9 23.4,1.9 | C13.2 42.65,45.15 v43.4,45.9 | 23.4,1.9 60.2,1.9 | R20.1 60.22,1.92 60.2,1.9 | v23.4,9.5 23.4,1.9
  Top 0.6: C17.2 39.04,5.79 C18.2 | R14.1 v20.4,46.5
  Bottom 0.3: U10.EXP 45.74,22.72 U10.3 48.2,22.7 48.5,23 v48.5,23.6 48.5,23.7 47.9,24.3 U10.M | SW1.P$1 68.4,8.6 67.8,9.2 65.15,9.2 C15.2
  Bottom 0.5: v39.8,36.3 37.1,36.3 v31.1,30.3 28.3,33.1 v28.3,43.3 | v21.5,35.5 v21.5,40.3 21.5,45.4 v20.4,46.5 v16.3,46.5 | C15.2 65.1,8.3 v64.3,7.5 | v52.8,15.9 51,17.7 C23.1 48.95,16.85 48.3,16.2 43.7,16.2 43.05,16.85 C22.1 | v48.9,9.3 51.7,12.1 v51.8,12.1 | v48.5,20.7 49.15,21.35 C21.1 C19.1 53.35,21.35 57.3,17.4 CN3.GND 62.7,17.4 63.2,17.9 63.2,21.6 64.1,22.5 v64.1,25.3 | v30.1,23.7 v24.5,23.7 23.4,22.6 v23.4,9.5 | R36.2 4.95,17.85 v4.3,17.2 | R35.2 4.95,10.85 v4.3,10.2 | v62.2,43.2 62.2,44.8 59.4,47.6 v55,47.6 53.2,49.4 52.2,49.4 | v4.3,19.5 4.3,26.2 6.3,28.2 6.3,44.1 11.6,49.4 52.2,49.4 | v43.4,45.9 v47.5,41.8 51.5,41.8 52.2,42.5 52.2,49.4
  Bottom 0.6: v23.4,9.5 25.4,7.5 v32.2,7.5 35.9,11.2 TP6.P$1
  other vias: 2,42.1 2,48 2,33.5 2,25.1 2,13.6 2,2 9.9,5.1 9.9,2 16.1,5.2 16.1,2 21.2,5.1 27.7,5 21.2,12.7 27.7,12.7 43.4,7.6 43.4,2.9 18.2,16 24.5,16 15.4,19.2 27.7,19.2 21.1,19.2 40.7,15 68,2 68,19.1 59.2,34.3 59.2,38.3 56.3,41 59.3,46.5 59.3,48.9 49.8,38 49.8,34.3 42.2,34.2 38.4,46.8 31.8,46.8 37.2,39.2 32.3,38.8 27.2,36.4 26.9,39.3 18.5,38.7 6.2,29.9 31.3,16
  pour Top: 0.3,49.7 63.3,49.7 63.3,26.4 63.3,26.3 69.7,26.3 69.7,0.3 0.3,0.3
  pour Bottom: 0.3,49.7 63.3,49.7 63.3,26.3 69.7,26.3 69.7,0.3 0.3,0.3
IN1
  Top 0.3: U4.2 22.27,38.33 22.8,37.8 22.8,32.4 23.55,31.65 R8.2
INT  (via drill 0.35)
  Top 0.5: Q1.1 30.55,46.65 31.39,45.8 U3.1 34.8,45.8 35.5,45.1 v35.5,44.1 | U7.26 46.96,28.44 46.4,29 v46.4,34.7
  Bottom 0.5: v35.5,44.1 35.5,43.4 44.2,34.7 v46.4,34.7
IO0
  Top 0.5: Q3.3 33.5,19.7 36.3,22.5 42,22.5 45.69,26.19 U7.25
IO13
  Top 0.5: R33.2 42.35,39.85 43.05,40.55 U7.16
IO15
  Top 0.5: U7.23 R34.2
LED1  (via drill 0.35)
  Top 0.5: R29.2 10.8,14.2 10.1,14.9 9.2,14.9 6,18.1 v6,25.7 | U7.8 53.31,46.09 51.8,47.6 v51.3,47.6
  Bottom 0.3: v6,25.7 7.6,27.3 7.6,44.1 11.9,48.4 45.9,48.4 46.7,47.6 v51.3,47.6
LED2  (via drill 0.35)
  Top 0.5: R28.2 13.17,15.43 12.3,16.3 9.8,16.3 7.2,18.9 v7.2,24.1 | U7.27 48.23,28.97 v47.5,29.7
  Bottom 0.3: v7.2,24.1 8.2,24.1 11.4,27.3 39.5,27.3 41.9,29.7 v47.5,29.7
LED3  (via drill 0.35)
  Top 0.5: U7.14 v45.69,47.09 v45.7,47.1 | R27.2 15.55,15.35 13,17.9 10.2,17.9 8.3,19.8 v8.3,25.7
  Bottom 0.3: v8.3,25.7 8.3,43.8 12.2,47.7 45.1,47.7 v45.7,47.1
MOSI  (via drill 0.35)
  Top 0.5: U5.4 12.8,40.36 v12.8,39.2 | U7.37 60.93,28.77 v59.7,30
  Bottom 0.3: v12.8,39.2 14.3,39.2 25.5,28 39.2,28 41.7,30.5 51.5,30.5 52,30 v59.7,30
N$1
  Top 0.5: U1.P$4 34.42,28.48 C1.1
N$2
  Top 0.5: C1.2 R2.2 39.55,30.2 R1.1 37.85,32.5 R3.1
N$3
  Top 0.5: U2.3 36.13,34.34 37,35.2 37.75,35.2 C4.1 38.55,35.25 39.55,34.25 R3.2
N$4
  Top 0.5: U2.2 33.34,33.06 32.7,33.7 32.7,35.6 32.3,36 32.3,37.7 | R5.1 32.3,37.7 | 32.3,37.7 R4.2
N$5
  Top 0.5: R4.1 C5.1
N$6
  Top 0.5: U2.1 32.91,31.8 31.8,32.9 31.8,35 31.2,35.6 U2.5 29.94,36.16 29.45,36.65 R5.2
N$7
  Top 0.5: R7.1 R6.2 27.55,33.45 28.43,34.34 U2.6
N$8
  Top 0.5: R6.1 25.96,35.16 25.5,34.7 25.5,33.9 25.04,33.44 C6.1
N$9
  Top 0.5: U2.7 28.77,33.06 28.1,32.4 28.1,30.5 27.55,29.95 R7.2 R8.1
N$10
  Top 0.5: 51.08,17.73 C16.1 | R21.2 48.85,4.2 47.8,4.2 47.72,4.12 U8.1
  Top 0.6: 51.08,17.73 Q2.2 53.2,17.7 54.5,17.7 55.4,16.8 D1.C | R21.2 49.78,4.18 50.7,5.1 50.7,13.6 49.4,14.9 49.4,16.9 50.15,17.65 C16.1
N$11
  Top 0.3: 19.68,32.48 R10.2 | R9.1 19.65,36.55 20.77,37.67 U4.3
  Top 0.5: R9.1 R10.2 C8.1
N$12
  Top 0.5: U5.8 R12.2
N$13
  Top 0.5: U3.2 33.05,44.45 R13.2 25.45,44.45 25.2,44.2 R12.1
N$14
  Top 0.5: Q1.3 28.7,45.5 28.05,46.15 R13.1 25.45,46.15 25.1,46.5 R14.2
N$15
  Top 0.3: U4.5 26.48,37.02 C7.1
  Top 0.5: U3.5 36.01,41.99 34.73,43.27 U3.3 31.46,43.27 29.45,41.25 C7.1
N$24
  Top 0.5: R24.1 39.6,20.3 39.85,20.05 Q4.1
N$25  (via drill 0.35)
  Top 0.5: v46.3,25.6 50.3,25.6 50.95,24.95 R11.1
  Bottom 0.3: U10.26 45.7,25 v46.3,25.6
N$26
  Top 0.5: Q3.1 36.25,18.05 36.6,17.7 R23.1
N$27  (via drill 0.35)
  Top 0.3: v54.4,21.5 53.6,22.3 51,22.3 v50.2,23.1
  Bottom 0.3: CN3.D+ 56.9,19 v54.4,21.5 | v50.2,23.1 49.3,23.1 48.4,22.2 U10.4
N$28
  Bottom 0.3: CN3.D- 57.4,19.8 54.9,22.3 49.2,22.3 48.6,21.7 U10.5
N$29
  Bottom 0.3: SW2.P$2 1.6,8.6 2.2,9.2 5.85,9.2 5.95,9.1
  Bottom 0.5: 5.95,9.1 R35.1
N$31
  Bottom 0.3: SW3.P$2 1.6,15.6 2.2,16.2 5.95,16.2 R36.1
N$32
  Top 0.3: LED3.P$2 14.05,10.06 R27.1
N$33
  Top 0.5: R25.1 39,9.7 39.6,9.1 44,9.1 45.35,10.45 U9.1
N$34
  Top 0.5: R25.2 36.75,12.15 36.05,11.45 LED2.C
N$35
  Top 0.3: LED3.P$3 13.2,11.53 R28.1
N$36
  Top 0.3: LED3.P$4 12.65,8.15 12.1,8.7 12.1,10.26 R29.1
N$37
  Top 0.5: U9.5 R26.2
N$38
  Top 0.5: R21.1 47.72,5.88 47.58,6.02 U8.3
N$39
  Top 0.5: LED1.A 36.05,6.85 36.5,6.4 R30.1
N$40
  Top 0.3: B1.PLUS 10.55,21.45
  Top 0.5: B1.PLUS R31.1 13.85,23.9 D2.C
N$41
  Top 0.5: B1.MINUS 12.5,28.5 13.8,27.2 D2.A 14.95,25.1 Q5.3
N$42
  Top 0.3: U4.8 25.65,40.05 26.05,40.45 R16.2
PWM_BUZ  (via drill 0.35)
  Top 0.5: Q5.1 19.05,24.15 19.15,24.25 R32.1 21.95,24.25 v22.3,24.6 | U7.33 55.85,28.85 v55.5,29.2
  Bottom 0.3: v55.5,29.2 53.6,27.3 42.5,27.3 40.4,25.2 22.9,25.2 v22.3,24.6
RESET  (via drill 0.35)
  Top 0.5: Q4.3 42.7,15.9 v43.8,14.8 | v59.6,14.8 61,14.8 | 61,14.8 v63.4,12.4 | 61,14.8 v61,25.3 | U7.3 59.66,42.94 v59.9,42.7
  Bottom 0.3: SW1.P$2 68.4,11.4 67.8,10.8 65.15,10.8 C15.1
  Bottom 0.5: v43.8,14.8 v59.6,14.8 | v59.9,42.7 61,41.6 v61,25.3 | v63.4,12.4 62.8,11.8 R18.1 C15.1
RTS  (via drill 0.35)
  Top 0.5: R23.2 39.6,17.7 40.05,18.15 Q4.2 v40.7,17 | R33.1 41.1,36 40.7,35.6 v40.7,24.3
  Bottom 0.3: U10.24 44.7,25.7 44,26.4 42.8,26.4 v40.7,24.3
  Bottom 0.5: v40.7,24.3 v40.7,17 40.7,16.3 39.8,15.4 TP4.P$1
RXD  (via drill 0.35)
  Top 0.5: R17.1 56.45,23.25 v56.2,23.5
  Bottom 0.3: U10.25 45.2,25.62 46.08,26.5 53.2,26.5 v56.2,23.5
  Bottom 0.5: v56.2,23.5 57.7,23.5 58.4,24.2 TP3.P$1
RXD0
  Top 0.5: U7.34 57.12,26.02 56.05,24.95 R15.2
SUBSCRIBE  (via drill 0.35)
  Top 0.5: 50.8,27.13 U7.29 50.77,28.77 v51.2,29.2
  Bottom 0.3: v51.2,29.2 50.1,28.1 42.3,28.1 40.1,25.9 13.5,25.9 7.8,20.2 7.8,14.9 3.6,10.7 2.3,10.7 1.6,11.4 SW2.P$1
TXD  (via drill 0.35)
  Top 0.5: R11.2 R15.1 55.05,23.25 v56.2,22.1
  Bottom 0.5: TP2.P$1 v56.2,22.1
TXD0
  Top 0.5: R17.2 U7.35
VBAT
  Top 0.5: C20.2 47.6,13.05 | Q2.3 49.18,18.68 47.6,17.1 47.6,13.05 | U9.3 46.9,12.35 47.6,13.05
  Top 0.6: Q2.3 58.02,18.68 59,17.7 59,16 57.9,14.9 57.9,10.85 BT1.PWR@1 60.25,8.5 R19.2
VBUS  (via drill 0.35)
  Top 0.5: 53.2,19.6 Q2.1 | 53.2,19.65 Q2.1 | 53.15,19.65 Q2.1 | U9.4 43.5,13.4
  Top 0.6: 53.15,19.65 R22.2 47.95,19.65 v46,17.7 46,15.6 43.8,13.4 43.5,13.4 35.8,13.4 33.95,11.55 LED2.A | v59,20.6 D1.A 55.4,20.6 54.43,19.63 Q2.1
  Bottom 0.3: 47.3,17.75 C23.2 47.25,18.75 46.7,19.3 U10.8
  Bottom 0.5: C22.2 v46,17.7 C23.2 | CN3.VBUS v59,20.6
VREF
  Top 0.5: U6.2 13.44,36.94 13.6,37.1 C11.1 14.35,39.55 16.46,41.66 U5.6
WIFI_OVERRIDE  (via drill 0.35)
  Top 0.5: U7.28 v49.5,29.5
  Bottom 0.3: v49.5,29.5 48.9,28.9 42.1,28.9 39.8,26.6 12.5,26.6 3.6,17.7 2.3,17.7 1.6,18.4 SW3.P$1

### Text on the board
Top: top | Noise Detector | Noisy rev. a | 2018 eptecon
Bottom: bot | Noise Detector | Noisy rev. a | 2018 eptecon